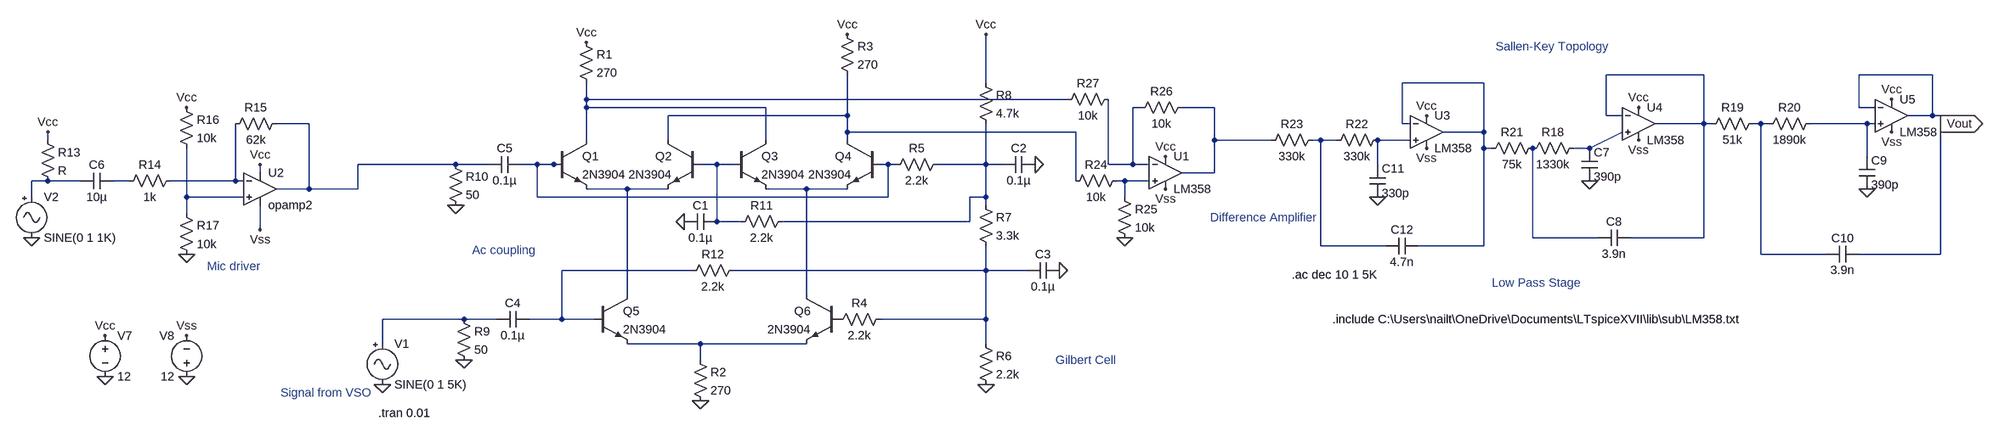
[diagram p0: schematic Receiver.asc]
Receiver.asc, the LTspice schematic file:
Version 4
SHEET 1 3396 680
WIRE 2400 -32 2208 -32
WIRE 2848 -32 2704 -32
WIRE 992 -16 992 -112
WIRE 1968 -16 1808 -16
WIRE 208 16 208 -16
WIRE 1152 16 208 16
WIRE 208 32 208 16
WIRE 560 32 208 32
WIRE 1296 32 1280 32
WIRE 1440 32 1376 32
WIRE 2704 32 2704 -32
WIRE 2736 32 2704 32
WIRE 720 48 720 -32
WIRE 720 48 368 48
WIRE 2208 48 2208 -32
WIRE 2240 48 2208 48
WIRE 2848 48 2848 -32
WIRE 2848 48 2800 48
WIRE 2864 48 2848 48
WIRE -336 64 -400 64
WIRE 1808 64 1808 -16
WIRE 1824 64 1808 64
WIRE 2400 64 2400 -32
WIRE 2400 64 2304 64
WIRE 2416 64 2400 64
WIRE 2512 64 2496 64
WIRE 2528 64 2512 64
WIRE 2720 64 2608 64
WIRE 2736 64 2720 64
WIRE 2864 64 2864 48
WIRE 720 80 720 48
WIRE 1168 80 720 80
WIRE 1968 80 1968 -16
WIRE 1968 80 1888 80
WIRE -848 96 -848 80
WIRE 208 96 208 32
WIRE 368 96 368 48
WIRE 560 96 560 32
WIRE 720 96 720 80
WIRE 1440 96 1440 32
WIRE 1552 96 1440 96
WIRE 1648 96 1632 96
WIRE 1680 96 1648 96
WIRE 1824 96 1760 96
WIRE 1968 112 1968 80
WIRE 1984 112 1968 112
WIRE 2176 112 2240 80
WIRE 2176 112 2144 112
WIRE 2720 128 2720 64
WIRE -48 144 -240 144
WIRE 16 144 -48 144
WIRE 112 144 80 144
WIRE 144 144 112 144
WIRE 160 144 144 144
WIRE 464 144 432 144
WIRE 496 144 464 144
WIRE 800 144 784 144
WIRE 816 144 800 144
WIRE 992 144 992 64
WIRE 992 144 896 144
WIRE 1024 144 992 144
WIRE 1232 144 1232 16
WIRE 1280 144 1280 32
WIRE 1280 144 1232 144
WIRE 1312 144 1280 144
WIRE 1760 144 1760 96
WIRE -432 160 -432 144
WIRE 1440 160 1440 96
WIRE 1440 160 1376 160
WIRE -848 176 -880 176
WIRE -784 176 -848 176
WIRE -688 176 -720 176
WIRE -480 176 -480 64
WIRE -480 176 -608 176
WIRE -464 176 -480 176
WIRE 1168 176 1168 80
WIRE 1264 176 1248 176
WIRE 1312 176 1264 176
WIRE -336 192 -336 64
WIRE -336 192 -400 192
WIRE -240 192 -240 144
WIRE -240 192 -336 192
WIRE 288 192 208 192
WIRE 368 192 288 192
WIRE 640 192 560 192
WIRE 720 192 640 192
WIRE -880 208 -880 176
WIRE -576 208 -576 112
WIRE -464 208 -576 208
WIRE 112 208 112 144
WIRE 800 208 800 144
WIRE 800 208 112 208
WIRE 992 208 992 144
WIRE 992 208 960 208
WIRE 1264 208 1264 176
WIRE 992 224 992 208
WIRE -576 240 -576 208
WIRE 464 256 464 144
WIRE 512 256 464 256
WIRE 960 256 960 208
WIRE 960 256 592 256
WIRE -432 272 -432 224
WIRE 2064 288 2064 112
WIRE 2192 288 2064 288
WIRE 2400 288 2400 64
WIRE 2400 288 2256 288
WIRE 1648 304 1648 96
WIRE 1776 304 1648 304
WIRE 1968 304 1968 112
WIRE 1968 304 1840 304
WIRE 2512 320 2512 64
WIRE 2640 320 2512 320
WIRE 2864 320 2864 64
WIRE 2864 320 2704 320
WIRE 416 352 160 352
WIRE 992 352 992 304
WIRE 992 352 496 352
WIRE 1072 352 992 352
WIRE 288 400 288 192
WIRE 640 400 640 192
WIRE -32 448 -192 448
WIRE 32 448 -32 448
WIRE 160 448 160 352
WIRE 160 448 96 448
WIRE 224 448 160 448
WIRE 992 448 992 352
WIRE 992 448 784 448
WIRE -192 496 -192 448
WIRE 432 496 288 496
WIRE 640 496 432 496
WIRE 992 496 992 448
WIRE 432 528 432 496
FLAG 208 -96 Vcc
FLAG 720 -112 Vcc
FLAG 400 256 0
FLAG 432 608 0
FLAG 992 576 0
FLAG 1088 144 0
FLAG 992 -112 Vcc
FLAG 1136 352 0
FLAG -32 528 0
FLAG -192 576 0
FLAG -48 224 0
FLAG 1344 128 Vcc
FLAG 1344 192 Vss
FLAG -880 288 0
FLAG -848 80 Vcc
FLAG -432 144 Vcc
FLAG -432 272 Vss
FLAG -576 320 0
FLAG -576 32 Vcc
FLAG 1856 48 Vcc
FLAG 1856 112 Vss
FLAG 2272 32 Vcc
FLAG 2272 96 Vss
FLAG 2768 16 Vcc
FLAG 2768 80 Vss
FLAG 2176 176 0
FLAG 2720 192 0
FLAG 1760 208 0
FLAG -736 560 0
FLAG -576 560 0
FLAG -736 480 Vcc
FLAG -576 480 Vss
FLAG 2864 64 Vout
IOPIN 2864 64 Out
FLAG 1264 288 0
SYMBOL res 192 -112 R0
SYMATTR InstName R1
SYMATTR Value 270
SYMBOL res 704 -128 R0
SYMATTR InstName R3
SYMATTR Value 270
SYMBOL cap 464 240 R90
WINDOW 0 0 32 VBottom 2
WINDOW 3 32 32 VTop 2
SYMATTR InstName C1
SYMATTR Value 0.1µ
SYMBOL res 416 512 R0
SYMATTR InstName R2
SYMATTR Value 270
SYMBOL res 800 432 R90
WINDOW 0 0 56 VBottom 2
WINDOW 3 32 56 VTop 2
SYMATTR InstName R4
SYMATTR Value 2.2k
SYMBOL res 912 128 R90
WINDOW 0 0 56 VBottom 2
WINDOW 3 32 56 VTop 2
SYMATTR InstName R5
SYMATTR Value 2.2k
SYMBOL res 976 480 R0
SYMATTR InstName R6
SYMATTR Value 2.2k
SYMBOL res 976 208 R0
SYMATTR InstName R7
SYMATTR Value 3.3k
SYMBOL cap 1088 128 R90
WINDOW 0 0 32 VBottom 2
WINDOW 3 32 32 VTop 2
SYMATTR InstName C2
SYMATTR Value 0.1µ
SYMBOL res 976 -32 R0
SYMATTR InstName R8
SYMATTR Value 4.7k
SYMBOL cap 1136 336 R90
WINDOW 0 0 32 VBottom 2
WINDOW 3 32 32 VTop 2
SYMATTR InstName C3
SYMATTR Value 0.1µ
SYMBOL cap 96 432 R90
WINDOW 0 0 32 VBottom 2
WINDOW 3 32 32 VTop 2
SYMATTR InstName C4
SYMATTR Value 0.1µ
SYMBOL res -48 432 R0
SYMATTR InstName R9
SYMATTR Value 50
SYMBOL Misc\\signal -192 480 R0
WINDOW 123 0 0 Left 2
WINDOW 39 0 0 Left 2
SYMATTR InstName V1
SYMATTR Value SINE(0 1 5K)
SYMBOL cap 80 128 R90
WINDOW 0 0 32 VBottom 2
WINDOW 3 32 32 VTop 2
SYMATTR InstName C5
SYMATTR Value 0.1µ
SYMBOL res -64 128 R0
SYMATTR InstName R10
SYMATTR Value 50
SYMBOL res 608 240 R90
WINDOW 0 0 56 VBottom 2
WINDOW 3 32 56 VTop 2
SYMATTR InstName R11
SYMATTR Value 2.2k
SYMBOL res 512 336 R90
WINDOW 0 0 56 VBottom 2
WINDOW 3 32 56 VTop 2
SYMATTR InstName R12
SYMATTR Value 2.2k
SYMBOL npn 144 96 R0
SYMATTR InstName Q1
SYMATTR Value 2N3904
SYMBOL npn 432 96 M0
SYMATTR InstName Q2
SYMATTR Value 2N3904
SYMBOL npn 784 96 M0
SYMATTR InstName Q4
SYMATTR Value 2N3904
SYMBOL npn 496 96 R0
SYMATTR InstName Q3
SYMATTR Value 2N3904
SYMBOL npn 224 400 R0
SYMATTR InstName Q5
SYMATTR Value 2N3904
SYMBOL npn 704 400 M0
SYMATTR InstName Q6
SYMATTR Value 2N3904
SYMBOL Opamps\\opamp2 1344 96 R0
SYMATTR InstName U1
SYMATTR Value LM358
SYMBOL Misc\\signal -880 192 R0
SYMATTR InstName V2
SYMBOL res -864 80 R0
SYMATTR InstName R13
SYMBOL Opamps\\opamp2 -432 128 R0
SYMATTR InstName U2
SYMBOL cap -720 160 R90
WINDOW 0 0 32 VBottom 2
WINDOW 3 32 32 VTop 2
SYMATTR InstName C6
SYMATTR Value 10µ
SYMBOL res -592 160 R90
WINDOW 0 0 56 VBottom 2
WINDOW 3 32 56 VTop 2
SYMATTR InstName R14
SYMATTR Value 1k
SYMBOL res -592 16 R0
SYMATTR InstName R16
SYMATTR Value 10k
SYMBOL res -592 224 R0
SYMATTR InstName R17
SYMATTR Value 10k
SYMBOL res -384 48 R90
WINDOW 0 0 56 VBottom 2
WINDOW 3 32 56 VTop 2
SYMATTR InstName R15
SYMATTR Value 62k
SYMBOL Opamps\\opamp2 1856 16 R0
SYMATTR InstName U3
SYMATTR Value LM358
SYMBOL Opamps\\opamp2 2272 0 R0
SYMATTR InstName U4
SYMATTR Value LM358
SYMBOL Opamps\\opamp2 2768 -16 R0
SYMATTR InstName U5
SYMATTR Value LM358
SYMBOL cap 2160 112 R0
SYMATTR InstName C7
SYMATTR Value 390p
SYMBOL res 2160 96 R90
WINDOW 0 0 56 VBottom 2
WINDOW 3 32 56 VTop 2
SYMATTR InstName R18
SYMATTR Value 1330k
SYMBOL cap 2256 272 R90
WINDOW 0 0 32 VBottom 2
WINDOW 3 32 32 VTop 2
SYMATTR InstName C8
SYMATTR Value 3.9n
SYMBOL res 2512 48 R90
WINDOW 0 0 56 VBottom 2
WINDOW 3 32 56 VTop 2
SYMATTR InstName R19
SYMATTR Value 51k
SYMBOL res 2624 48 R90
WINDOW 0 0 56 VBottom 2
WINDOW 3 32 56 VTop 2
SYMATTR InstName R20
SYMATTR Value 1890k
SYMBOL cap 2704 128 R0
SYMATTR InstName C9
SYMATTR Value 390p
SYMBOL cap 2704 304 R90
WINDOW 0 0 32 VBottom 2
WINDOW 3 32 32 VTop 2
SYMATTR InstName C10
SYMATTR Value 3.9n
SYMBOL res 2080 96 R90
WINDOW 0 0 56 VBottom 2
WINDOW 3 32 56 VTop 2
SYMATTR InstName R21
SYMATTR Value 75k
SYMBOL cap 1744 144 R0
SYMATTR InstName C11
SYMATTR Value 330p
SYMBOL res 1776 80 R90
WINDOW 0 0 56 VBottom 2
WINDOW 3 32 56 VTop 2
SYMATTR InstName R22
SYMATTR Value 330k
SYMBOL res 1648 80 R90
WINDOW 0 0 56 VBottom 2
WINDOW 3 32 56 VTop 2
SYMATTR InstName R23
SYMATTR Value 330k
SYMBOL cap 1840 288 R90
WINDOW 0 0 32 VBottom 2
WINDOW 3 32 32 VTop 2
SYMATTR InstName C12
SYMATTR Value 4.7n
SYMBOL voltage -736 464 R0
WINDOW 123 0 0 Left 2
WINDOW 39 0 0 Left 2
SYMATTR InstName V7
SYMATTR Value 12
SYMBOL voltage -576 576 R180
WINDOW 0 24 96 Left 2
WINDOW 3 24 16 Left 2
WINDOW 123 0 0 Left 2
WINDOW 39 0 0 Left 2
SYMATTR InstName V8
SYMATTR Value 12
SYMBOL res 1264 160 R90
WINDOW 0 0 56 VBottom 2
WINDOW 3 32 56 VTop 2
SYMATTR InstName R24
SYMATTR Value 10k
SYMBOL res 1248 192 R0
SYMATTR InstName R25
SYMATTR Value 10k
SYMBOL res 1392 16 R90
WINDOW 0 0 56 VBottom 2
WINDOW 3 32 56 VTop 2
SYMATTR InstName R26
SYMATTR Value 10k
SYMBOL res 1248 0 R90
WINDOW 0 0 56 VBottom 2
WINDOW 3 32 56 VTop 2
SYMATTR InstName R27
SYMATTR Value 10k
TEXT -200 632 Left 2 !.tran 0.01
TEXT 1128 528 Left 2 ;Gilbert Cell
TEXT -536 344 Left 2 ;Mic driver
TEXT -16 312 Left 2 ;Ac coupling
TEXT -392 592 Left 2 ;Signal from VSO
TEXT 1672 448 Left 2 !.include C:\\Users\\nailt\\OneDrive\\Documents\\LTspiceXVII\\lib\\sub\\LM358.txt
TEXT 1592 360 Left 2 !.ac dec 10 1 5K
TEXT 1432 248 Left 2 ;Difference Amplifier
TEXT 1984 376 Left 2 ;Low Pass Stage
TEXT 1992 -88 Left 2 ;Sallen-Key Topology

The netlist it stands for:
* Receiver.asc
R1 Vcc N003 270
R3 Vcc N006 270
C1 N014 0 0.1µ
R2 N027 0 270
R4 N025 P001 2.2k
R5 N015 N013 2.2k
R6 N025 0 2.2k
R7 N015 N025 3.3k
C2 0 N015 0.1µ
R8 Vcc N015 4.7k
C3 0 N025 0.1µ
C4 N024 N026 0.1µ
R9 N026 0 50
V1 N026 0 SINE(0 1 5K)
C5 N013 N007 0.1µ
R10 N007 0 50
R11 N015 N014 2.2k
R12 N025 N024 2.2k
Q1 N003 N013 N020 0 2N3904
Q2 N006 N014 N020 0 2N3904
Q4 N006 N013 N021 0 2N3904
Q3 N003 N014 N021 0 2N3904
Q5 N020 N024 N027 0 2N3904
Q6 N021 P001 N027 0 2N3904
XU1 N019 N004 Vcc Vss N005 LM358  ; pins In+ In- V+ V- OUT
V2 N016 0 SINE(0 1 1K)
R13 Vcc N016 R
XU2 N022 N018 Vcc Vss N007 opamp2  ; pins In+ In- V+ V- OUT
C6 N017 N016 10µ
R14 N018 N017 1k
R16 Vcc N022 10k
R17 N022 0 10k
R15 N007 N018 62k
XU3 N011 N002 Vcc Vss N002 LM358  ; pins In+ In- V+ V- OUT
XU4 N012 N001 Vcc Vss N001 LM358  ; pins In+ In- V+ V- OUT
XU5 N009 Vout Vcc Vss Vout LM358  ; pins In+ In- V+ V- OUT
C7 N012 0 390p
R18 N012 N023 1330k
C8 N001 N023 3.9n
R19 N008 N001 51k
R20 N009 N008 1890k
C9 N009 0 390p
C10 Vout N008 3.9n
R21 N023 N002 75k
C11 N011 0 330p
R22 N011 N010 330k
R23 N010 N005 330k
C12 N002 N010 4.7n
V7 Vcc 0 12
V8 0 Vss 12
R24 N019 N006 10k
R25 N019 0 10k
R26 N005 N004 10k
R27 N004 N003 10k
.model NPN NPN
.model PNP PNP
.lib standard.bjt
.tran 0.01
* Gilbert Cell
* Mic driver
* Ac coupling
* Signal from VSO
.include C:\Users\nailt\OneDrive\Documents\LTspiceXVII\lib\sub\LM358.txt
.ac dec 10 1 5K
* Difference Amplifier
* Low Pass Stage
* Sallen-Key Topology
.backanno
.end